# Altium schematic sheet stm32_schematic.SchDoc
size A3; SheetNumber: 1; SheetTotal: 1
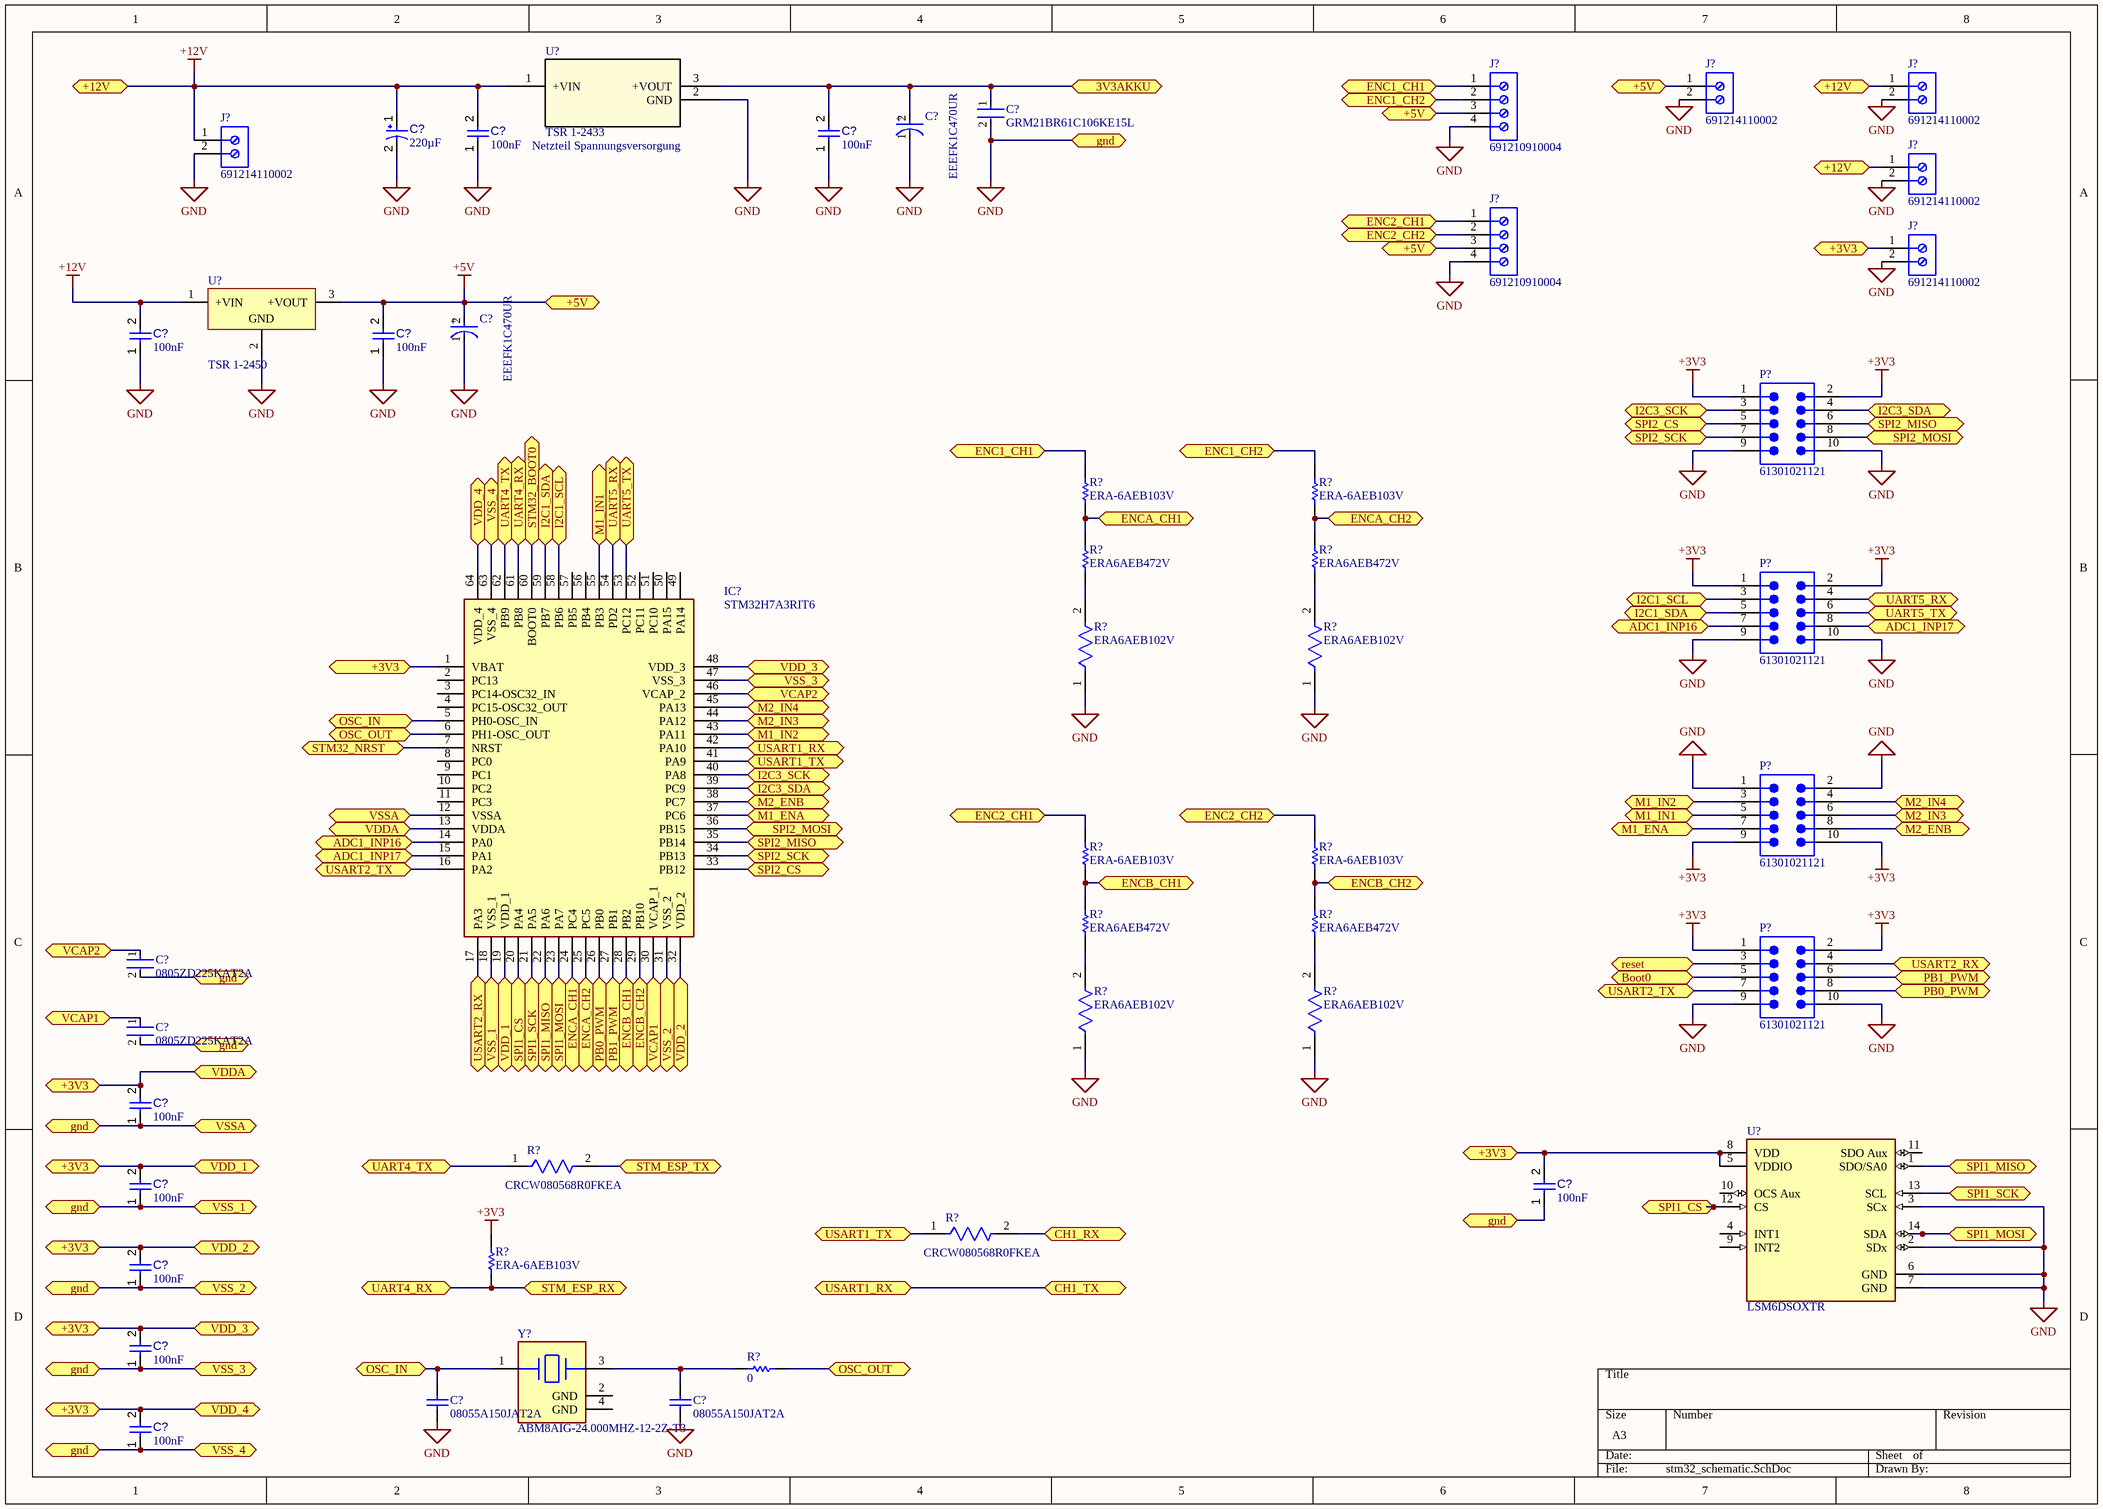
[diagram p0: stm32_schematic.SchDoc]

## Parts
(Parts that share a designator on the sheet are numbered #1, #2 ... from top to bottom, then left to right.)
C?#1  GRM21BR61C106KE15L  [FP-GRM21B-0_1-IPC_C]
C?#2  value 220µF  [CAPPR65-500-1250X1000X1350]  (hidden comment: ECA-1HM221)
C?#3  EEEFK1C470UR  [FP-FKC-MFG]
C?#4  value 100nF  [CAPC2013X95X50LL10T25]  (hidden comment: Capacitor 100 nF +/-10% 50 V 0805)
C?#5  value 100nF  [CAPC2013X95X50LL10T25]  (hidden comment: Capacitor 100 nF +/-10% 50 V 0805)
C?#6  EEEFK1C470UR  [FP-FKC-MFG]
C?#7  value 100nF  [CAPC2013X95X50LL10T25]  (hidden comment: Capacitor 100 nF +/-10% 50 V 0805)
C?#8  value 100nF  [CAPC2013X95X50LL10T25]  (hidden comment: Capacitor 100 nF +/-10% 50 V 0805)
C?#9  0805ZD225KAT2A  [FP-0805-L_2_01_0_2-W_1_25-IPC_B]
C?#10  0805ZD225KAT2A  [FP-0805-L_2_01_0_2-W_1_25-IPC_B]
C?#11  value 100nF  [CAPC2013X95X50LL10T25]  (hidden comment: Capacitor 100 nF +/-10% 50 V 0805)
C?#12  value 100nF  [CAPC2013X95X50LL10T25]  (hidden comment: Capacitor 100 nF +/-10% 50 V 0805)
C?#13  value 100nF  [CAPC2013X95X50LL10T25]  (hidden comment: Capacitor 100 nF +/-10% 50 V 0805)
C?#14  value 100nF  [CAPC2013X95X50LL10T25]  (hidden comment: Capacitor 100 nF +/-10% 50 V 0805)
C?#15  value 100nF  [CAPC2013X95X50LL10T25]  (hidden comment: Capacitor 100 nF +/-10% 50 V 0805)
C?#16  08055A150JAT2A  [CAPC2013X140X50LL20T25]
C?#17  08055A150JAT2A  [CAPC2013X140X50LL20T25]
C?#18  value 100nF  [CAPC2013X95X50LL10T25]  (hidden comment: Capacitor 100 nF +/-10% 50 V 0805)
IC?  STM32H7A3RIT6  [QFP50P1200X1200X160-64N]
J?#1  691210910004  [691210910004]
J?#2  691214110002  [691214110002]
J?#3  691214110002  [691214110002]
J?#4  691214110002  [691214110002]
J?#5  691214110002  [691214110002]
J?#6  691210910004  [691210910004]
J?#7  691214110002  [691214110002]
P?#1  61301021121  [61301021121]
P?#2  61301021121  [61301021121]
P?#3  61301021121  [61301021121]
P?#4  61301021121  [61301021121]
R?#1  ERA-6AEB103V  [RESC2013X60X40LL20T25_A]
R?#2  ERA-6AEB103V  [RESC2013X60X40LL20T25_A]
R?#3  ERA6AEB472V  [RESC2013X60X40ML20T25]
R?#4  ERA6AEB472V  [RESC2013X60X40ML20T25]
R?#5  ERA6AEB102V  [FP-ERA6A-IPC_C]
R?#6  ERA6AEB102V  [FP-ERA6A-IPC_C]
R?#7  ERA-6AEB103V  [RESC2013X60X40LL20T25_A]
R?#8  ERA-6AEB103V  [RESC2013X60X40LL20T25_A]
R?#9  ERA6AEB472V  [RESC2013X60X40ML20T25]
R?#10  ERA6AEB472V  [RESC2013X60X40ML20T25]
R?#11  ERA6AEB102V  [FP-ERA6A-IPC_C]
R?#12  ERA6AEB102V  [FP-ERA6A-IPC_C]
R?#13  CRCW080568R0FKEA  [FP-CRCW0805-e3-IPC_C]
R?#14  CRCW080568R0FKEA  [FP-CRCW0805-e3-IPC_C]
R?#15  ERA-6AEB103V  [RESC2013X60X40LL20T25_A]
R?#16  value 0  [RESC2013X60X35ML10T20]  (hidden comment: Resistor 0R +/- 5% 0805 125 mW)
U?#1  TSR 1-2433  [TSR1-SINGLE_TRP]
U?#2  TSR 1-2450  [TRACO-SIP-3_V]
U?#3  LSM6DSOXTR  [FP-LGA-14L-DM00249496-MFG]
Y?  ABM8AIG-24.000MHZ-12-2Z-T3  [FP-ABM8AIG-MFG]

## Ports
3V3AKKU (bidir, see stm32_schematic[1C], stm32_schematic[1D], stm32_schematic[2B], stm32_schematic[6D], stm32_schematic[7A]), +3V3 (bidir, see stm32_schematic[1C], stm32_schematic[1D], stm32_schematic[2B], stm32_schematic[5A], stm32_schematic[6D]), +3V3 (bidir, see stm32_schematic[1C], stm32_schematic[1D], stm32_schematic[2B], stm32_schematic[5A], stm32_schematic[6D], stm32_schematic[7A]), +3V3 (bidir, see stm32_schematic[1C], stm32_schematic[1D], stm32_schematic[2B], stm32_schematic[5A], stm32_schematic[7A]), +3V3 (bidir, see stm32_schematic[1C], stm32_schematic[1D], stm32_schematic[5A], stm32_schematic[6D], stm32_schematic[7A]), +3V3 (bidir, see stm32_schematic[1D], stm32_schematic[2B], stm32_schematic[5A], stm32_schematic[6D], stm32_schematic[7A]), +5V (bidir, see stm32_schematic[3A], stm32_schematic[6A]), +5V (bidir, see stm32_schematic[3A], stm32_schematic[6A], stm32_schematic[7A]), +5V (bidir, see stm32_schematic[6A], stm32_schematic[7A]), +12V (bidir, see stm32_schematic[1A], stm32_schematic[7A]), +12V (bidir, see stm32_schematic[7A]), ADC1_INP16 (bidir, see stm32_schematic[2C]), ADC1_INP16 (bidir, see stm32_schematic[7B]), ADC1_INP17 (bidir, see stm32_schematic[2C]), ADC1_INP17 (bidir, see stm32_schematic[8B]), Boot0 (bidir, see stm32_schematic[3B]), CH1_RX (bidir), CH1_TX (bidir), ENC1_CH1 (bidir, see stm32_schematic[4B]), ENC1_CH1 (bidir, see stm32_schematic[6A]), ENC1_CH2 (bidir, see stm32_schematic[5B]), ENC1_CH2 (bidir, see stm32_schematic[6A]), ENC2_CH1 (bidir, see stm32_schematic[4C]), ENC2_CH1 (bidir, see stm32_schematic[6A]), ENC2_CH2 (bidir, see stm32_schematic[5C]), ENC2_CH2 (bidir, see stm32_schematic[6A]), ENCA_CH1 (bidir, see stm32_schematic[3C]), ENCA_CH1 (bidir, see stm32_schematic[5B]), ENCA_CH2 (bidir, see stm32_schematic[3C]), ENCA_CH2 (bidir, see stm32_schematic[6B]), ENCB_CH1 (bidir, see stm32_schematic[3C]), ENCB_CH1 (bidir, see stm32_schematic[5C]), ENCB_CH2 (bidir, see stm32_schematic[3C]), ENCB_CH2 (bidir, see stm32_schematic[6C]), gnd (bidir, see stm32_schematic[1C], stm32_schematic[1D], stm32_schematic[5A]), gnd (bidir, see stm32_schematic[1C], stm32_schematic[1D], stm32_schematic[5A], stm32_schematic[6D]), gnd (bidir, see stm32_schematic[1C], stm32_schematic[1D], stm32_schematic[6D]), I2C1_SCL (bidir, see stm32_schematic[3B]), I2C1_SCL (bidir, see stm32_schematic[7B]), I2C1_SDA (bidir, see stm32_schematic[3B]), I2C1_SDA (bidir, see stm32_schematic[7B]), I2C3_SCK (bidir, see stm32_schematic[3C]), I2C3_SCK (bidir, see stm32_schematic[7B]), I2C3_SDA (bidir, see stm32_schematic[3C]), I2C3_SDA (bidir, see stm32_schematic[8B]), M1_ENA (bidir, see stm32_schematic[3C]), M1_ENA (bidir, see stm32_schematic[7C]), M1_IN1 (bidir, see stm32_schematic[3B]), M1_IN1 (bidir, see stm32_schematic[7C]), M1_IN2 (bidir, see stm32_schematic[3B]), M1_IN2 (bidir, see stm32_schematic[7C]), M2_ENB (bidir, see stm32_schematic[3C]), M2_ENB (bidir, see stm32_schematic[8C]), M2_IN3 (bidir, see stm32_schematic[3B]), M2_IN3 (bidir, see stm32_schematic[8C]), M2_IN4 (bidir, see stm32_schematic[3B]), M2_IN4 (bidir, see stm32_schematic[8C]), OSC_IN (bidir, see stm32_schematic[2B]), OSC_IN (bidir, see stm32_schematic[2D]), OSC_OUT (bidir, see stm32_schematic[2B]), OSC_OUT (bidir, see stm32_schematic[4D]), PB0_PWM (bidir, see stm32_schematic[3C]), PB0_PWM (bidir, see stm32_schematic[8C]), PB1_PWM (bidir, see stm32_schematic[3C]), PB1_PWM (bidir, see stm32_schematic[8C]), reset (bidir, see stm32_schematic[2B]), SPI1_CS (bidir, see stm32_schematic[2C]), SPI1_CS (bidir, see stm32_schematic[7D]), SPI1_MISO (bidir, see stm32_schematic[3C]), SPI1_MISO (bidir, see stm32_schematic[8D]), SPI1_MOSI (bidir, see stm32_schematic[3C]), SPI1_MOSI (bidir, see stm32_schematic[8D]), SPI1_SCK (bidir, see stm32_schematic[3C]), SPI1_SCK (bidir, see stm32_schematic[8D]), SPI2_CS (bidir, see stm32_schematic[3C]), SPI2_CS (bidir, see stm32_schematic[7B]), SPI2_MISO (bidir, see stm32_schematic[3C]), SPI2_MISO (bidir, see stm32_schematic[8B]), SPI2_MOSI (bidir, see stm32_schematic[3C]), SPI2_MOSI (bidir, see stm32_schematic[8B]), SPI2_SCK (bidir, see stm32_schematic[3C]), SPI2_SCK (bidir, see stm32_schematic[7B]), STM32_BOOT0 (bidir, see stm32_schematic[7C]), STM32_NRST (bidir, see stm32_schematic[7C]), STM_ESP_RX (bidir), STM_ESP_TX (bidir), UART4_RX (bidir, see stm32_schematic[7C]), UART4_TX (bidir, see stm32_schematic[7C]), UART5_RX (bidir, see stm32_schematic[3B]), UART5_RX (bidir, see stm32_schematic[8B]), UART5_TX (bidir, see stm32_schematic[3B]), UART5_TX (bidir, see stm32_schematic[8B]), USART1_RX (bidir, see stm32_schematic[7C]), USART1_TX (bidir, see stm32_schematic[7C]), USART2_RX (bidir, see stm32_schematic[2C]), USART2_RX (bidir, see stm32_schematic[8C]), USART2_TX (bidir, see stm32_schematic[2C]), USART2_TX (bidir, see stm32_schematic[7C]), VCAP1 (bidir, see stm32_schematic[1C]), VCAP1 (bidir, see stm32_schematic[3C]), VCAP2 (bidir, see stm32_schematic[1C]), VCAP2 (bidir, see stm32_schematic[3B]), VDD_1 (bidir, see stm32_schematic[1D]), VDD_1 (bidir, see stm32_schematic[2C]), VDD_2 (bidir, see stm32_schematic[1D]), VDD_2 (bidir, see stm32_schematic[3C]), VDD_3 (bidir, see stm32_schematic[1D]), VDD_3 (bidir, see stm32_schematic[3B]), VDD_4 (bidir, see stm32_schematic[1D]), VDD_4 (bidir, see stm32_schematic[2B]), VDDA (bidir, see stm32_schematic[1C]), VDDA (bidir, see stm32_schematic[2C]), VSS_1 (bidir, see stm32_schematic[1D]), VSS_1 (bidir, see stm32_schematic[2C]), VSS_2 (bidir, see stm32_schematic[1D]), VSS_2 (bidir, see stm32_schematic[3C]), VSS_3 (bidir, see stm32_schematic[1D]), VSS_3 (bidir, see stm32_schematic[3B]), VSS_4 (bidir, see stm32_schematic[1D]), VSS_4 (bidir, see stm32_schematic[2B]), VSSA (bidir, see stm32_schematic[1C]), VSSA (bidir, see stm32_schematic[2C])

## Nets
+3V3: P?#1.1 P?#1.2 P?#2.1 P?#2.2 P?#3.9 P?#3.10 P?#4.1 P?#4.2 R?#15.2
+5V: C?#6.2(A) C?#8.2 J?#1.3 J?#2.1 J?#6.3 U?#2.3(+VOUT) ; port +5V
+12V: C?#2.1 C?#4.2 C?#7.2 J?#3.1 J?#4.1 J?#5.1 U?#1.1(+VIN) U?#2.1(+VIN) ; port +12V
GND: C?#1.2 C?#2.2 C?#3.1(C) C?#4.1 C?#5.1 C?#6.1(C) C?#7.1 C?#8.1 C?#9.2 C?#10.2 C?#11.1 C?#12.1 C?#13.1 C?#14.1 C?#15.1 C?#16.1 C?#17.1 C?#18.1 IC?.12(VSSA) IC?.18(VSS_1) IC?.31(VSS_2) IC?.47(VSS_3) IC?.63(VSS_4) J?#1.4 J?#2.2 J?#3.2 J?#4.2 J?#5.2 J?#6.4 J?#7.2 P?#1.9 P?#1.10 P?#2.9 P?#2.10 P?#3.1 P?#3.2 P?#4.9 P?#4.10 R?#5.1 R?#6.1 R?#11.1 R?#12.1 U?#1.2(GND) U?#2.2(GND) U?#3.2(SDx) U?#3.3(SCx) U?#3.6(GND) U?#3.7(GND) ; port VSSA, port gnd, port VSS_1, port VSS_2, port VSS_3, port VSS_4
3V3AKKU: C?#1.1 C?#3.2(A) C?#5.2 U?#1.3(+VOUT) ; port 3V3AKKU
+3V3: C?#11.2 C?#12.2 C?#13.2 C?#14.2 C?#15.2 C?#18.2 IC?.1(VBAT) IC?.13(VDDA) IC?.19(VDD_1) IC?.32(VDD_2) IC?.48(VDD_3) IC?.64(VDD_4) J?#7.1 U?#3.5(VDDIO) U?#3.8(VDD) ; port VDDA, port +3V3, port VDD_1, port VDD_2, port VDD_3, port VDD_4  [a separate net that carries the same name]
ADC1_INP16: IC?.14(PA0) P?#2.7 ; port ADC1_INP16
ADC1_INP17: IC?.15(PA1) P?#2.8 ; port ADC1_INP17
CH1_RX: R?#14.2 ; port CH1_RX
CH1_TX: IC?.42(PA10) ; port CH1_TX, port USART1_RX
ENC1_CH1: J?#1.1 R?#1.2 ; port ENC1_CH1
ENC1_CH2: J?#1.2 R?#2.2 ; port ENC1_CH2
ENC2_CH1: J?#6.1 R?#7.2 ; port ENC2_CH1
ENC2_CH2: J?#6.2 R?#8.2 ; port ENC2_CH2
ENCA_CH1: IC?.24(PC4) R?#1.1 R?#3.2 ; port ENCA_CH1
ENCA_CH2: IC?.25(PC5) R?#2.1 R?#4.2 ; port ENCA_CH2
ENCB_CH1: IC?.28(PB2) R?#7.1 R?#9.2 ; port ENCB_CH1
ENCB_CH2: IC?.29(PB10) R?#8.1 R?#10.2 ; port ENCB_CH2
I2C1_SCL: IC?.58(PB6) P?#2.3 ; port I2C1_SCL
I2C1_SDA: IC?.59(PB7) P?#2.5 ; port I2C1_SDA
I2C3_SCK: IC?.40(PA8) P?#1.3 ; port I2C3_SCK
I2C3_SDA: IC?.39(PC9) P?#1.4 ; port I2C3_SDA
M1_ENA: IC?.37(PC6) P?#3.7 ; port M1_ENA
M1_IN1: IC?.55(PB3) P?#3.5 ; port M1_IN1
M1_IN2: IC?.43(PA11) P?#3.3 ; port M1_IN2
M2_ENB: IC?.38(PC7) P?#3.8 ; port M2_ENB
M2_IN3: IC?.44(PA12) P?#3.6 ; port M2_IN3
M2_IN4: IC?.45(PA13) P?#3.4 ; port M2_IN4
OSC_IN: C?#16.2 IC?.5(PH0-OSC_IN) Y?.1 ; port OSC_IN
OSC_OUT: IC?.6(PH1-OSC_OUT) R?#16.2 ; port OSC_OUT
PB0_PWM: IC?.26(PB0) P?#4.8 ; port PB0_PWM
PB1_PWM: IC?.27(PB1) P?#4.6 ; port PB1_PWM
reset: P?#4.3 ; port reset
SPI1_CS: IC?.20(PA4) U?#3.12(CS) ; port SPI1_CS
SPI1_MISO: IC?.22(PA6) U?#3.1(SDO/SA0) ; port SPI1_MISO
SPI1_MOSI: IC?.23(PA7) U?#3.14(SDA) ; port SPI1_MOSI
SPI1_SCK: IC?.21(PA5) U?#3.13(SCL) ; port SPI1_SCK
SPI2_CS: IC?.33(PB12) P?#1.5 ; port SPI2_CS
SPI2_MISO: IC?.35(PB14) P?#1.6 ; port SPI2_MISO
SPI2_MOSI: IC?.36(PB15) P?#1.8 ; port SPI2_MOSI
SPI2_SCK: IC?.34(PB13) P?#1.7 ; port SPI2_SCK
STM32_BOOT0: IC?.60(BOOT0) ; port STM32_BOOT0
STM32_NRST: IC?.7(NRST) ; port STM32_NRST
STM_ESP_RX: IC?.61(PB8) R?#15.1 ; port STM_ESP_RX, port UART4_RX
STM_ESP_TX: R?#13.2 ; port STM_ESP_TX
UART4_TX: IC?.62(PB9) R?#13.1 ; port UART4_TX
UART5_RX: IC?.54(PD2) P?#2.4 ; port UART5_RX
UART5_TX: IC?.53(PC12) P?#2.6 ; port UART5_TX
USART1_TX: IC?.41(PA9) R?#14.1 ; port USART1_TX
USART2_RX: IC?.17(PA3) P?#4.4 ; port USART2_RX
USART2_TX: IC?.16(PA2) P?#4.7 ; port USART2_TX
VCAP1: C?#10.1 IC?.30(VCAP_1) ; port VCAP1
VCAP2: C?#9.1 IC?.46(VCAP_2) ; port VCAP2
NetC?#17_2: C?#17.2 R?#16.1 Y?.3
NetR?#3_1: R?#3.1 R?#5.2
NetR?#4_1: R?#4.1 R?#6.2
NetR?#9_1: R?#9.1 R?#11.2
NetR?#10_1: R?#10.1 R?#12.2

Not connected (* = marked no-connect by the designer): IC? 2(PC13) 3(PC14-OSC32_IN) 4(PC15-OSC32_OUT) 8(PC0) 9(PC1) 10(PC2) 11(PC3) 49(PA14) 50(PA15) 51(PC10) 52(PC11) 56(PB4) 57(PB5); P?#4 5; U?#3 4(INT1) 9(INT2) 10(OCS_Aux) 11(SDO_Aux); Y? 2(GND) 4(GND)

## Notes on the sheet
- Netzteil Spannungsversorgung
- (in symbol CMP-05427-002132-1) +

## Library data of the parts
C?#1 = CMP-2007-03453-2: Chip Multilayer Ceramic Capacitors for General Purpose, 0805, 10uF, X5R, 15%, 10%, 16V; Radiation Hardening: No; Thickness: 0.053inch; Voltage Rating (DC): 16V; Lead Free: Lead Free; Package Quantity: 1; Width: 1.25mm; Case Code (Imperial): 0805; Depth: 1.25mm; Packaging: Tape and Reel; Dielectric: X5R; Max Operating Temperature: 85°C; Tolerance: 10%; Voltage Rating: 16V; Voltage: 16V; Capacitance: 10uF; Height: 1.25mm; Case Code (Metric): 2012; Material: Ceramic; Mount: Surface Mount; Case/Package: 0805; REACH SVHC: No SVHC; Length: 2mm; Min Operating Temperature: -55°C; Termination: SMD/SMT
C?#2 = CMP-001-00028-7: Aluminum Electrolytic Capacitor, 220 uF, +/- 20%, 50 V, -40 to 85 degC, 2-Pin THD, RoHS, Bulk; Manufacturer: Panasonic; Ripple Current (AC): 400mA; Voltage Rating: 50V; Case/Package: Radial; Packaging: Bulk; Package Quantity: 200; Min Operating Temperature: -40°C; Datasheet Version: Mar-16; Package Reference: CAPPR65-500-1250X1000X1350; Mounting Technology: TH; Ripple Current: 400mA; Pins: 2; Package Description: 2-Pin Radial Lead, Dia 10 mm, Body Length 12.5 mm; RoHS Compliant: True; Max Operating Temperature: 85°C; Lead Pitch: 5mm; Tolerance: 20%; Manufacturer URL: http://www.panasonic.com/; Diameter: 10mm; Capacitor Type: Electrolytic; Datasheet URL: http://industrial.panasonic.com/cdbs/www-data/pdf/RDF0000/DMF0000COL68.pdf
C?#3 C?#6 = CMP-05427-002132-1: CAP ALUM 47UF 20% 16V SMD; Dielectric Material: Aluminium; ESR (Equivalent Series Resistance): 700mR; Ripple Current: 160mA; Life (Hours): 2000Hour; Leakage Current: 3uA; Voltage: 10V; Length: 5.8mm; Voltage Rating: 16V; Ratings: AEC-Q200; Package Quantity: 1000; Min Operating Temperature: -55°C; Mount: Surface Mount; Width: 6.5mm; Voltage Rating (DC): 16V; Radiation Hardening: No; Diameter: 5mm; RoHS Compliant: Yes; Reach SVHC Compliant: Yes; Termination: SMD/SMT; Material: Aluminium; Ripple Current (AC): 160mA; Impedance: 700mR; Series: FK; Height - Seated (Max): 0.228inch; Packaging: Tape and Reel; Height: 5.8mm; Capacitance: 47uF; Contact Plating: Tin; Construction: Cylindrical; Number of Pins: 2; Lead Free: Lead Free; Tolerance: 20%; Max Operating Temperature: 105°C; Case/Package: Radial
C?#4 C?#5 C?#7 C?#8 C?#11-C?#15 C?#18 = CMP-001-00018-6: Chip Capacitor, 100 nF, +/- 10%, 50 V, 0805 (2012 Metric); Capacitor Type: Ceramic; Voltage Rating: 50V; Pins: 2; Max Operating Temperature: 125°C; Min Operating Temperature: -55°C; Mounting Technology: SM; Case/Package: 0805; RoHS Compliant: True; Tolerance: 10%
C?#9 C?#10 = CMP-2000-05810-2: General Purpose Ceramic Capacitor, 0805, 2.2uF, 10%, X5R, 15%, 10V; Insulation Resistance: 500MR; Dissipation Factor: 5%; Termination: SMD/SMT; Length: 2.01mm; Lead Free: Lead Free; Voltage: 10V; Height: 1.4mm; Contact Plating: Tin; Dielectric: X5R; Voltage Rating (DC): 10V; REACH SVHC: No SVHC; Voltage Rating: 10V; Depth: 1.25mm; Min Operating Temperature: -55°C; Tolerance: 10%; Case Code (Metric): 2012; Max Operating Temperature: 85°C; Radiation Hardening: No; Dielectric Material: Ceramic; Packaging: Tape and Reel; Construction: Flat; Case Code (Imperial): 0805; RoHS Compliant: Yes; Package Quantity: 1; Capacitance: 2.2uF; Series: -; Size: 1.4mm; Number of Pins: 2; Width: 0.049inch; Mount: Surface Mount; Thickness: 0.055inch; Case/Package: 0805
C?#16 C?#17 = CMP-2007-04621-1: Manufacturer: AVX Interconnect / Elco; Part Number: 08055A150JAT2A
IC? = STM32H7A3RIT6: Integrated Circuit; Manufacturer_Name: STMicroelectronics; Datasheet Link: https://www.st.com/resource/en/datasheet/stm32h7a3ai.pdf; Height: 1.6mm; Manufacturer_Part_Number: STM32H7A3RIT6; Mouser Part Number: 511-STM32H7A3RIT6; Mouser Price/Stock: https://www.mouser.co.uk/ProductDetail/STMicroelectronics/STM32H7A3RIT6?qs=xZ%2FP%252Ba9zWqZAEQXxnLVEdg%3D%3D; Arrow Part Number: STM32H7A3RIT6; Arrow Price/Stock: https://www.arrow.com/en/products/stm32h7a3rit6/stmicroelectronics
J?#1 J?#6 = CMP-1502-02458-2: NexarPartId: 105950651
J?#2-J?#5 J?#7 = CMP-1502-02464-2: NexarPartId: 18818288; Plating: Brass, Steel; Current: 10A; Pitch: 3.5052mm; Number of Levels: 1; Number of Contacts: 2; Wire Gauge (Min): 16AWG; Voltage: 300V; Wire Gauge (Max): 24AWG; Stripping Length: -6mm; Number of Pins: 2; Number of Rows: 1; REACH SVHC: Unknown; RoHS: Compliant; Housing Material: Nylon; Termination: Screw; Mount: Through Hole; Contact Plating: Brass, Tin; Number of Positions Per Level: 2; Color: Blue, Green; Width: 7.9mm; Voltage Rating: 300V; Length: 7.4mm; Current Rating: 10A; Wire/Cable Gauge: 24AWG; Packaging: Box; Max Operating Temperature: 105°C; Lead Pitch: 3.5mm; Height: 8.7mm; Contact Material: Brass; Min Operating Temperature: -40°C
P?#1-P?#4 = CMP-1502-01084-3: NexarPartId: 18818163; Connector Type: Male Pin; Insulation Resistance: 1GΩ; Row Spacing: 2.54mm; Insulation: Insulated; Number of Positions: 10; Current Rating: 3A; Voltage Rating: 250V; Gender: Male; Contact Resistance: 20mΩ; Contact Gender: Male; Number of Rows: 2; Min Operating Temperature: -40°C; Mount: Through Hole; Packaging: Bulk; Length: 12.7mm; Pitch: 2.54mm; RoHS: Compliant; Height: 2.54mm; Lead Pitch: 2.54mm; Number of Pins: 10; Housing Material: PBT; Orientation: Vertical; Flammability Rating: UL94 V-0; Termination: Through Hole; Width: 12.7mm; Color: Black; Contact Mating Length: 5.9944mm; Max Operating Temperature: 105°C; Operating Supply Voltage: 250V; Contact Material: Copper; Number of Contacts: 10; Contact Plating: Gold; REACH SVHC: Unknown
R?#1 R?#2 R?#7 R?#8 R?#15 = CMP-2001-00582-2: Metal Film Chip Resistor, High Reliability Type, 0.125 W, +/- 0.1%, -55 to 155 degC, 0805 (2012 Metric), RoHS, Tape and Reel; Voltage Rating: 100V; Power Rating: 125mW(1/8W); Brand: Panasonic; Temperature Coefficient: 25PPM/C; Resistance: 10kOhms; Product Category: ThinFilmResistors-SMD; Datasheet Version: 02/2016; Operating Temperature Range: -55Cto+155C; Length: 2mm; Mounting Technology: SurfaceMount; Manufacturer URL: http://www.panasonic.com/; Width: 1.25mm; Packaging: Reel; Product: ThinFilmResistorsSMD; Package / Case: 0805(2012metric); Termination Style: SMD/SMT; Tolerance: 0.1%; Datasheet URL: https://industrial.panasonic.com/cdbs/www-data/pdf/RDM0000/AOA0000C307.pdf; Package Description: 2-Pin Surface Mount Device, Body 2 x 1.25 mm; Factory Pack Quantity: 5000; Series: ERA-6A; Case Code - mm: 2012; RoHS: Details; Package Reference: 0805; Height: 0.5mm; Manufacturer: Panasonic; Case Code - in: 0805; Type: MetalFilmChipResistors
R?#3 R?#4 R?#9 R?#10 = CMP-2001-00644-1: Manufacturer: Panasonic; Part Number: ERA6AEB472V
R?#5 R?#6 R?#11 R?#12 = CMP-2001-00581-2: RES 1K OHM 0.1% 1/8W 0805; Temperature Coefficient: 25ppm/°C; Resistance: 1kR; Working Voltage: 100V; Max Power Dissipation: 125mW; Height: 0.5mm; Technology: THIN FILM; REACH SVHC: No SVHC; Packaging: Tape and Reel; Length: 2mm; Width: 1.25mm; Resistance Tolerance: 0.1%; Series: ERA-6A; Resistor Type: Thin Film; Number of Pins: 2; Case Code (Metric): 2012; Voltage Rating: 100V; Radiation Hardening: No; Construction: Rectangular; Mount: Surface Mount; Number of Terminations: 2; Case/Package: 0805; Min Operating Temperature: -55°C; Military Standard: Not; RoHS Compliant: Yes; Termination: SMD/SMT; Case Code (Imperial): 0805; Depth: 1.25mm; Power Rating: 125mW; Max Operating Temperature: 155°C; Contact Plating: Tin; Package Quantity: 5000; Tolerance: 0.1%
R?#13 R?#14 = CMP-1013-00378-3: RES Thick Film, 68Ω, 1%, 0.125W, 100ppm/°C, 0805; Voltage Rating (DC): 150V; Power Rating: 125mW; Resistance: 68R; Case Code (Metric): 2012; Height: 0.45mm; Depth: 1.25mm; Length: 2mm; Max Power Dissipation: 125mW; Termination: SMD/SMT; Packaging: Tape and Reel; Military Standard: Not; Width: 0.049inch; Radiation Hardening: No; Tolerance: 1%; Package Quantity: 5000; Voltage Rating: 150V; Temperature Coefficient: 100ppm/°C; Number of Terminations: 2; Case Code (Imperial): 0805; Weight: 0.000194oz; Min Operating Temperature: -55°C; Mount: Surface Mount; Case/Package: 0805; Features: Automotive AEC-Q200; Max Operating Temperature: 155°C; Lead Free: Lead Free; Composition: Thick Film; Contact Plating: Tin
R?#16 = CMP-009-00007-5: Chip Resistor, 0 Ohm, 0.125 W, -55 to 155 degC, 0805 (2012 Metric); Power: 125mW; Voltage Rating: 50V; RoHS Compliant: True; Max Operating Temperature: 155°C; Case/Package: 0805; Mounting Technology: SM; Min Operating Temperature: -55°C; Tolerance: 5%; Pins: 2
U?#1 = CMP-2000-05426-2: NexarPartId: 9539342; Nominal Output Voltage: 3.3V; Max Input Voltage: 36V; Max Output Power: 3.3W; Min Input Voltage: 4.75V; Nominal Supply Current: 1mA; Output Type: Fixed; Max Output Current: 1A; Min Input Voltage (DC): 5.5V; Efficiency: 79%; Number of Outputs: 1; Isolation: Isolated; Max Input Voltage (DC): 32V; Switching Frequency: 500kHz; Radiation Hardening: No; REACH SVHC: No SVHC; Mount: Through Hole; Height: 10.2mm; Max Operating Temperature: 85°C; RoHS: Compliant; Output Power: 3.3W; Min Supply Voltage: 4.75V; Weight: 1.9g; Power Rating: 3.3W; Number of Pins: 3; Output Current: 1A; Min Operating Temperature: -40°C; Length: 11.7mm; Case/Package: SIP; Output Voltage: 3.3V; Max Supply Voltage: 36V; Depth: 7.6mm; Width: 7.6mm
U?#2 = CMP-2000-05427-1: DC/DC converter, 5 VDC, 1000 mA, -40 to 85 degC, 3-Pin SIP, RoHS; Manufacturer: Tracopower; Output Voltage Nom.: 5V; Output Current Max: 1A; Product Range: TSR-1Series; DC / DC Converter Mounting: ThroughHole; Output Power Max: 5W; No. of Outputs: 1Output; Input Voltage DC Max: 36V; Approvals & Standards: IEC,UL; Input Voltage DC Min: 6.5V; DC / DC Converter Output Type: Fixed; Depth: 11.7mm; Package Reference: SIP-3; DC / DC Converter Type: SIP; Height: 10.2mm; Width: 7.6mm; Package Description: 3-Pin Single In-line Package, Body 11.7 x 7.6 mm, Pitch 2.54 mm; Manufacturer URL: http://www.tracopower.com/home; Datasheet Version: Jan-15; Datasheet URL: https://datasheet.ciiva.com/6815/tsr1-6815641.pdf
U?#3 = CMP-12177-000010-1: INEMO INERTIAL MODULE: 3D ACCELE; Manufacturer: STMicroelectronics; Sensor Type: Temperature,Accelerometer,Gyroscope; Accel Range: 2/4/8/16g; Accel Sensitivity: 0.061/0.122/0.244/0.488mV/g; Operating Supply Current: 0.55mA; Gyro Range: 125/250/500/1000/2000°/s; Gyro Sensitivity: 4.375/8.75/17.5/35/70LSB/°/s; Sensor Output: I2C,SPI,Other; Min Supply Voltage: 1.62V; Max Supply Voltage: 3.6V; Octopart: https://octopart.com/lsm6dsoxtr-stmicroelectronics-98102600; Package: LGA-14L-DM00249496; Footprint Url: https://www.st.com/content/ccc/resource/technical/document/technical_note/73/17/9c/16/dd/96/4a/01/CD00134799.pdf/files/CD00134799.pdf/jcr:content/translations/en.CD00134799.pdf; ComponentLink2Description: Datasheet; Mouser Description: LSM6DSOX: 3.6 V 3 Axis Accelerometer Gyroscope iNEMO Inertial Module - LGA-14L; ComponentLink2URL: https://www.st.com/resource/en/datasheet/lsm6dsox.pdf; Temperature Range Low: -40°C; Digikey Description: INEMO INERTIAL MODULE: 3D ACCELE; Lead Free: Yes; Device Class L3: Inertial Measurement Units (IMUs); Category: IC; Device Class L2: Motion Sensors; RoHS: TRUE; Temperature: -40°C to +85°C; Height: 0.86mm; Device Class L1: Sensors; Temperature Range High: +85°C; Manufacturer Part Number: LSM6DSOXTR; Automotive: No
Y? = CMP-27762-015716-1: Crystal 24MHz ±20ppm (Tol) ±50ppm (Stability) 12pF FUND 50Ω Automotive 4-Pin Ultra Mini-CSMD T/R; ESR (Equivalent Series Resistance): 50R; Series: ABM8AIG; RoHS Compliant: Yes; Load Capacitance: 12pF; Height: 0.031inch; Min Operating Temperature: -40°C; Mount: Surface Mount; Packaging: Cut Tape; Ratings: AEC-Q200; Case/Package: SMD/SMT; Frequency Stability: 50ppm; Max Operating Temperature: 125°C; Length: 0.126inch; Frequency: 24MHz; Frequency Tolerance: 20ppm; Width: 0.098inch